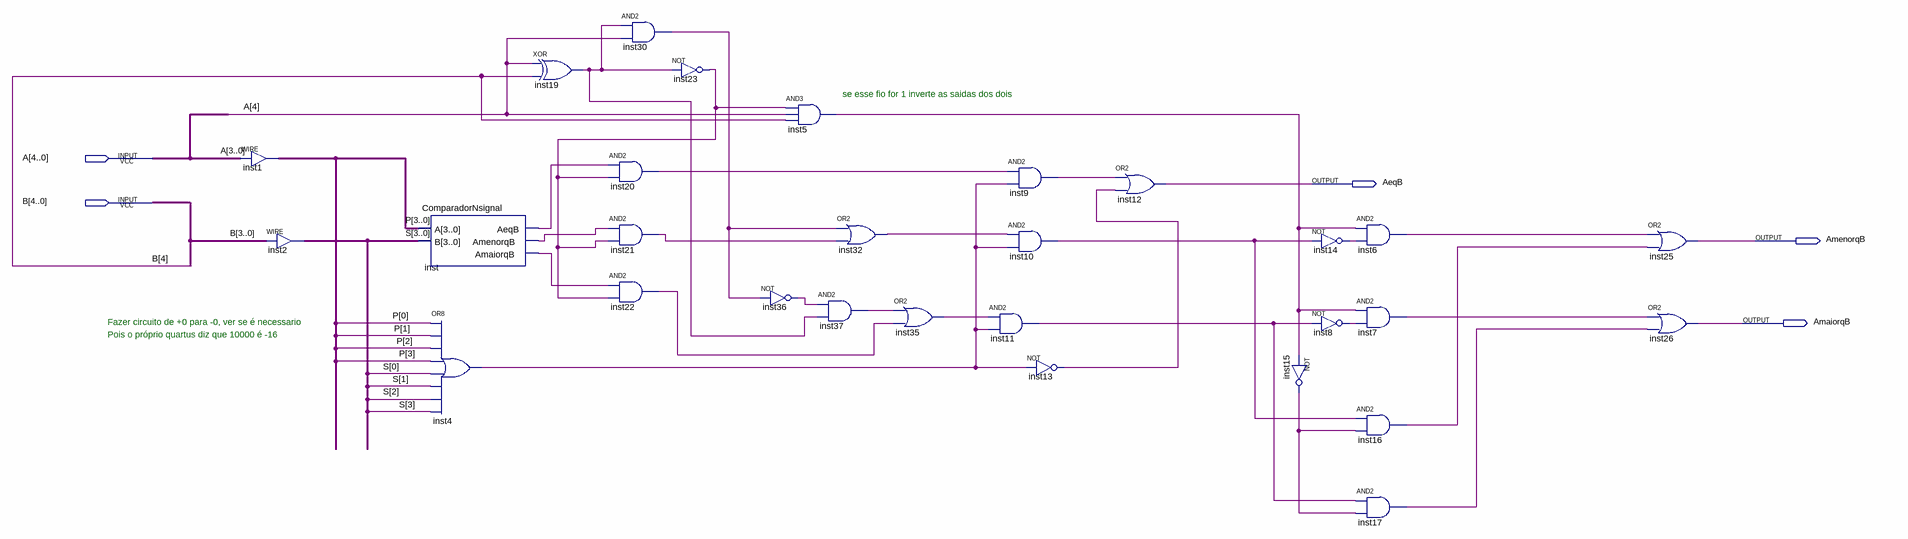
[diagram p0: schematic sheet]
// Quartus schematic ComparadorCSinal.bdf as structural Verilog: 29 symbols, 5 pins
module ComparadorCSinal (
  input  [4:0] A,
  input  [4:0] B,
  output AeqB,
  output AmenorqB,
  output AmaiorqB
);

  wire inst4_out, inst5_out, inst6_out, inst7_out, inst8_out, inst9_out, inst10_out, inst11_out, inst13_out,
       inst14_out, inst15_out, inst16_out, inst17_out, inst19_out, inst20_out, inst21_out, inst22_out,
       inst23_out, inst30_out, inst32_out, inst35_out, inst36_out, inst37_out, inst_aeqb, inst_amaiorqb,
       inst_amenorqb;
  wire [3:0] P, S;

  assign P = A[3:0];  // WIRE inst1
  assign S = B[3:0];  // WIRE inst2
  ComparadorNsignal inst (.A(P), .B(S), .AeqB(inst_aeqb), .AmenorqB(inst_amenorqb), .AmaiorqB(inst_amaiorqb));
  or inst4 (inst4_out, P[0], P[1], P[2], P[3], S[0], S[1], S[2], S[3]);
  xor inst19 (inst19_out, A[4], B[4]);
  and inst20 (inst20_out, inst_aeqb, inst23_out);
  and inst21 (inst21_out, inst_amenorqb, inst23_out);
  and inst22 (inst22_out, inst_amaiorqb, inst23_out);
  and inst30 (inst30_out, inst19_out, A[4]);
  not inst23 (inst23_out, inst19_out);
  not inst36 (inst36_out, inst30_out);
  and inst5 (inst5_out, inst23_out, A[4], B[4]);
  and inst37 (inst37_out, inst36_out, inst19_out);
  or inst32 (inst32_out, inst30_out, inst21_out);
  or inst35 (inst35_out, inst37_out, inst22_out);
  and inst9 (inst9_out, inst20_out, inst4_out);
  and inst10 (inst10_out, inst32_out, inst4_out);
  and inst11 (inst11_out, inst35_out, inst4_out);
  not inst13 (inst13_out, inst4_out);
  or inst12 (AeqB, inst9_out, inst13_out);
  not inst14 (inst14_out, inst10_out);
  not inst8 (inst8_out, inst11_out);
  not inst15 (inst15_out, inst5_out);
  and inst6 (inst6_out, inst5_out, inst14_out);
  and inst7 (inst7_out, inst5_out, inst8_out);
  and inst16 (inst16_out, inst10_out, inst15_out);
  and inst17 (inst17_out, inst11_out, inst15_out);
  or inst25 (AmenorqB, inst6_out, inst16_out);
  or inst26 (AmaiorqB, inst7_out, inst17_out);

  // Notes on the sheet:
  //   se esse fio for 1 inverte as saidas dos dois
  //   Fazer circuito de +0 para -0, ver se é necessario 
  //   Pois o próprio quartus diz que 10000 é -16
endmodule
